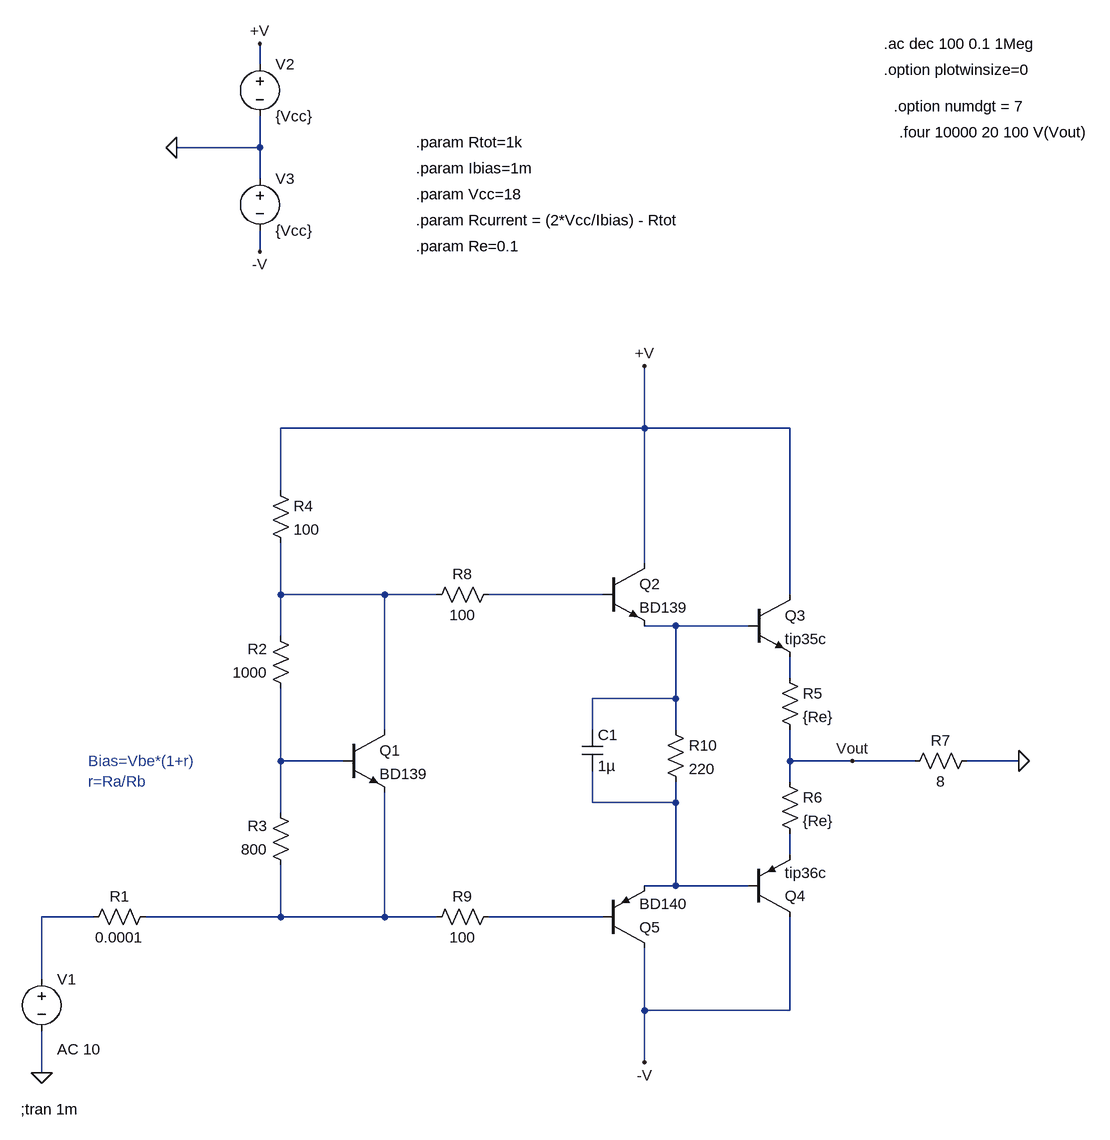
[diagram p0: schematic AC.asc]
AC.asc, the LTspice schematic file:
Version 4
SHEET 1 880 856
WIRE -576 -768 -576 -800
WIRE -576 -640 -576 -688
WIRE -576 -640 -704 -640
WIRE -576 -592 -576 -640
WIRE -576 -480 -576 -512
WIRE 16 -208 16 -304
WIRE 16 -208 -544 -208
WIRE 240 -208 16 -208
WIRE -544 -112 -544 -208
WIRE 16 0 16 -208
WIRE -544 48 -544 -32
WIRE -384 48 -544 48
WIRE -304 48 -384 48
WIRE -48 48 -224 48
WIRE 240 48 240 -208
WIRE 64 96 16 96
WIRE 176 96 64 96
WIRE -544 112 -544 48
WIRE 240 176 240 144
WIRE 64 208 64 96
WIRE 64 208 -64 208
WIRE -384 256 -384 48
WIRE -64 256 -64 208
WIRE 64 256 64 208
WIRE -544 304 -544 192
WIRE -448 304 -544 304
WIRE 240 304 240 256
WIRE 336 304 240 304
WIRE 432 304 336 304
WIRE 592 304 512 304
WIRE 240 336 240 304
WIRE -64 368 -64 320
WIRE 64 368 64 336
WIRE 64 368 -64 368
WIRE -544 384 -544 304
WIRE 240 448 240 416
WIRE 64 496 64 368
WIRE 64 496 16 496
WIRE 176 496 64 496
WIRE -832 544 -912 544
WIRE -544 544 -544 464
WIRE -544 544 -752 544
WIRE -384 544 -384 352
WIRE -384 544 -544 544
WIRE -304 544 -384 544
WIRE -48 544 -224 544
WIRE -912 640 -912 544
WIRE 16 688 16 592
WIRE 240 688 240 544
WIRE 240 688 16 688
WIRE 16 768 16 688
WIRE -912 784 -912 720
FLAG 16 -304 +V
FLAG 16 768 -V
FLAG -912 784 0
FLAG -704 -640 0
FLAG -576 -800 +V
FLAG -576 -480 -V
FLAG 592 304 0
FLAG 336 304 Vout
SYMBOL voltage -912 624 R0
WINDOW 123 24 124 Left 2
WINDOW 39 0 0 Left 0
SYMATTR Value2 AC 10
SYMATTR InstName V1
SYMATTR Value ""
SYMBOL res -736 528 R90
WINDOW 0 0 56 VBottom 2
WINDOW 3 32 56 VTop 2
SYMATTR InstName R1
SYMATTR Value 0.0001
SYMBOL res -528 208 R180
WINDOW 0 36 76 Left 2
WINDOW 3 36 40 Left 2
SYMATTR InstName R2
SYMATTR Value 1000
SYMBOL res -528 480 R180
WINDOW 0 36 76 Left 2
WINDOW 3 36 40 Left 2
SYMATTR InstName R3
SYMATTR Value 800
SYMBOL npn -448 256 R0
SYMATTR InstName Q1
SYMATTR Value BD139
SYMBOL npn -48 0 R0
SYMATTR InstName Q2
SYMATTR Value BD139
SYMBOL npn 176 48 R0
SYMATTR InstName Q3
SYMATTR Value tip35c
SYMBOL res -560 -128 R0
SYMATTR InstName R4
SYMATTR Value 100
SYMBOL pnp 176 544 M180
SYMATTR InstName Q4
SYMATTR Value tip36c
SYMBOL pnp -48 592 M180
SYMATTR InstName Q5
SYMATTR Value BD140
SYMBOL res 224 160 R0
SYMATTR InstName R5
SYMATTR Value {Re}
SYMBOL res 224 320 R0
SYMATTR InstName R6
SYMATTR Value {Re}
SYMBOL voltage -576 -784 R0
WINDOW 123 0 0 Left 0
WINDOW 39 0 0 Left 0
SYMATTR InstName V2
SYMATTR Value {Vcc}
SYMBOL voltage -576 -608 R0
WINDOW 123 0 0 Left 0
WINDOW 39 0 0 Left 0
SYMATTR InstName V3
SYMATTR Value {Vcc}
SYMBOL res 528 288 R90
WINDOW 0 0 56 VBottom 2
WINDOW 3 32 56 VTop 2
SYMATTR InstName R7
SYMATTR Value 8
SYMBOL res -208 32 R90
WINDOW 0 0 56 VBottom 2
WINDOW 3 32 56 VTop 2
SYMATTR InstName R8
SYMATTR Value 100
SYMBOL res -208 528 R90
WINDOW 0 0 56 VBottom 2
WINDOW 3 32 56 VTop 2
SYMATTR InstName R9
SYMATTR Value 100
SYMBOL res 48 240 R0
SYMATTR InstName R10
SYMATTR Value 220
SYMBOL cap -80 256 R0
SYMATTR InstName C1
SYMATTR Value 1µ
TEXT -840 304 Left 2 ;Bias=Vbe*(1+r)\nr=Ra/Rb
TEXT -336 -648 Left 2 !.param Rtot=1k
TEXT -336 -608 Left 2 !.param Ibias=1m
TEXT -336 -568 Left 2 !.param Vcc=18
TEXT -336 -528 Left 2 !.param Rcurrent = (2*Vcc/Ibias) - Rtot
TEXT -336 -488 Left 2 !.param Re=0.1
TEXT -944 840 Left 2 !;tran 1m
TEXT 384 -800 Left 2 !.ac dec 100 0.1 1Meg
TEXT 384 -760 Left 2 !.option plotwinsize=0
TEXT 400 -704 Left 2 !.option numdgt = 7
TEXT 408 -664 Left 2 !.four 10000 20 100 V(Vout)

The netlist it stands for:
* AC.asc
V1 N008 0 AC 10
R1 N009 N008 0.0001
R2 N005 N001 1000
R3 N009 N005 800
Q1 N001 N005 N009 0 BD139
Q2 +V N002 N003 0 BD139
Q3 +V N003 N004 0 tip35c
R4 +V N001 100
Q4 -V N006 N007 0 tip36c
Q5 -V N010 N006 0 BD140
R5 N004 Vout {Re}
R6 Vout N007 {Re}
V2 +V 0 {Vcc}
V3 0 -V {Vcc}
R7 0 Vout 8
R8 N002 N001 100
R9 N010 N009 100
R10 N003 N006 220
C1 N003 N006 1µ
.model NPN NPN
.model PNP PNP
.lib standard.bjt
* Bias=Vbe*(1+r)
* r=Ra/Rb
.param Rtot=1k
.param Ibias=1m
.param Vcc=18
.param Rcurrent = (2*Vcc/Ibias) - Rtot
.param Re=0.1
;tran 1m
.ac dec 100 0.1 1Meg
.option plotwinsize=0
.option numdgt = 7
.four 10000 20 100 V(Vout)
.backanno
.end